# Altium schematic sheet RPI 3.SchDoc
size A4; SheetNumber: 1; SheetTotal: 1
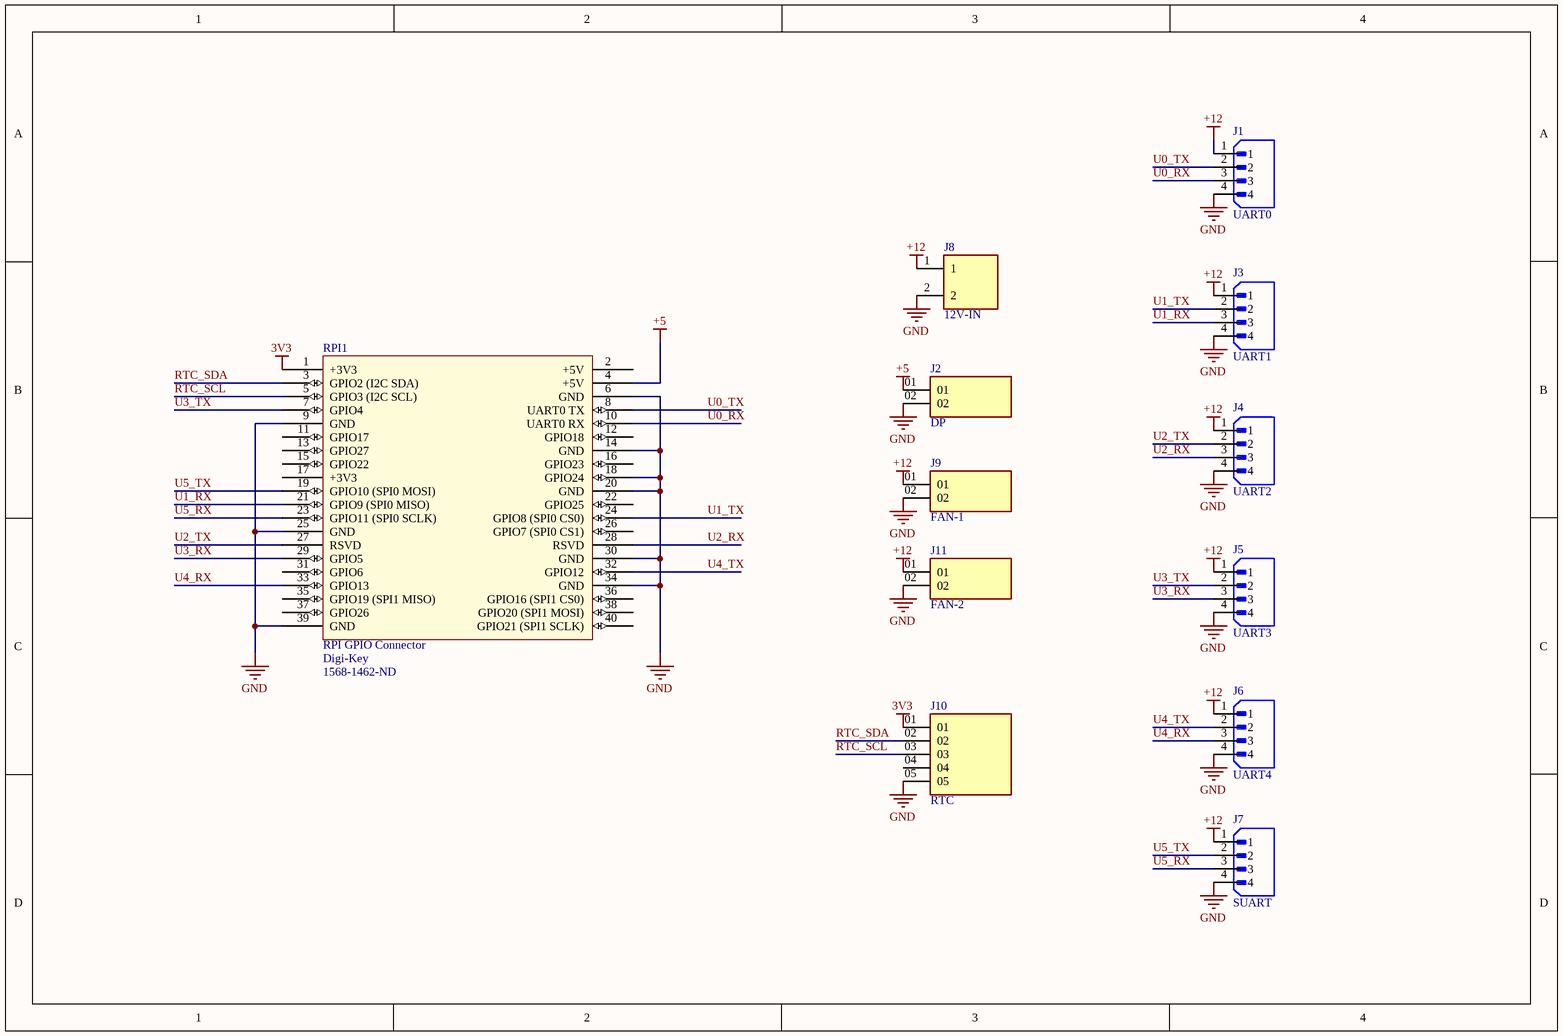
[diagram p0: RPI 3.SchDoc]

## Parts
J1  UART0  [JST_B4B-XH-A(LF)(SN)]
J2  DP  [SAMTEC_TSW-102-24-L-S]
J3  UART1  [JST_B4B-XH-A(LF)(SN)]
J4  UART2  [JST_B4B-XH-A(LF)(SN)]
J5  UART3  [JST_B4B-XH-A(LF)(SN)]
J6  UART4  [JST_B4B-XH-A(LF)(SN)]
J7  SUART  [JST_B4B-XH-A(LF)(SN)]
J8  12V-IN  [HANDSON_KF301-2P]
J9  FAN-1  [SAMTEC_TSW-102-24-L-S]
J10  RTC  [SAMTEC_TLW-105-06-T-S]
J11  FAN-2  [SAMTEC_TSW-102-24-L-S]
RPI1  RPI GPIO Connector  Supplier 1: Digi-Key  Supplier Part Number 1: 1568-1462-ND  [rpi]

## Nets
3V3: J10.01 RPI1.1(+3V3)
+5: J2.01 RPI1.4(+5V)
+12: J1.1 J3.1 J4.1 J5.1 J6.1 J7.1 J8.1 J9.01 J11.01
GND: J1.4 J2.02 J3.4 J4.4 J5.4 J6.4 J7.4 J8.2 J9.02 J10.05 J11.02 RPI1.6(GND) RPI1.9(GND) RPI1.14(GND) RPI1.18(GPIO24) RPI1.20(GND) RPI1.25(GND) RPI1.30(GND) RPI1.34(GND) RPI1.39(GND)
RTC_SCL: J10.03 RPI1.5(GPIO3_(I2C_SCL))
RTC_SDA: J10.02 RPI1.3(GPIO2_(I2C_SDA))
U0_RX: J1.3 RPI1.10(UART0_RX)
U0_TX: J1.2 RPI1.8(UART0_TX)
U1_RX: J3.3 RPI1.21(GPIO9_(SPI0_MISO))
U1_TX: J3.2 RPI1.24(GPIO8_(SPI0_CS0))
U2_RX: J4.3 RPI1.28(RSVD)
U2_TX: J4.2 RPI1.27(RSVD)
U3_RX: J5.3 RPI1.29(GPIO5)
U3_TX: J5.2 RPI1.7(GPIO4)
U4_RX: J6.3 RPI1.33(GPIO13)
U4_TX: J6.2 RPI1.32(GPIO12)
U5_RX: J7.3 RPI1.23(GPIO11_(SPI0_SCLK))
U5_TX: J7.2 RPI1.19(GPIO10_(SPI0_MOSI))

Not connected (* = marked no-connect by the designer): J10 04; RPI1 2(+5V) 11(GPIO17) 12(GPIO18) 13(GPIO27) 15(GPIO22) 16(GPIO23) 17(+3V3) 22(GPIO25) 26(GPIO7_(SPI0_CS1)) 31(GPIO6) 35(GPIO19_(SPI1_MISO)) 36(GPIO16_(SPI1_CS0)) 37(GPIO26) 38(GPIO20_(SPI1_MOSI)) 40(GPIO21_(SPI1_SCLK))

## Library data of the parts
J1 J3-J7 = B4B-XH-A(LF)(SN): Connector Header Through Hole 4 position 0.098 (2.50mm); MF: JST Sales; SnapEDA_Link: https://www.snapeda.com/parts/B4B-XH-A(LF)(SN)/JST+Sales+America+Inc./view-part/?ref=snap; Package: None; Value: *; MP: B4B-XH-A(LF)(SN); Check_prices: https://www.snapeda.com/parts/B4B-XH-A(LF)(SN)/JST+Sales+America+Inc./view-part/?ref=eda
J2 J9 J11 = TSW-102-24-L-S: Connector Header Through Hole 2 position 0.100 (2.54mm); MF: Samtec; SnapEDA_Link: https://www.snapeda.com/parts/TSW-102-24-L-S/Samtec%20Inc./view-part/930762/?ref=snap; Package: None; Availability: Bad; Price: None; Toby_UK-Purchase-URL: https://snapeda.com/shop?store=Toby+UK&id=930762; MP: TSW-102-24-L-S; Value: *; BuyPart: https://www.snapeda.com/parts/TSW-102-24-L-S/Samtec%20Inc./view-part/930762/?ref=eda
J8 = KF301-2P: 2 Pin Terminal Block 5mm Pitch; Price: None; Value: *; MP: KF301-2P; Package: None; Availability: Unavailable
J10 = TLW-105-06-T-S: Package: None; Price: None; Value: *; MP: TLW-105-06-T-S; Availability: Unavailable
RPI1 = rpi connector: GPIO Header for Raspberry Pi A+/B+/Pi 2/Pi 3 - 2x20; Manufacturer: SparkFun Electronics; Manufacturer Part Number: PRT-14017; Nils Minor: author; nilsminor@web.de: mail; RoHS: RoHS Compliant; Category: Development Boards, Kits, Programmers; Stock 1: 150; Pricing 1: 1=1.84 (EUR); Part Status: Active; Accessory Type: Connector; For Use With/Related Products: Raspberry Pi; ComponentLink1URL: https://cdn.sparkfun.com/datasheets/Dev/RaspberryPi/12313.pdf; ComponentLink1Description: https://cdn.sparkfun.com/datasheets/Dev/RaspberryPi/12313.pdf